# Altium project Current Loop.PrjPcb
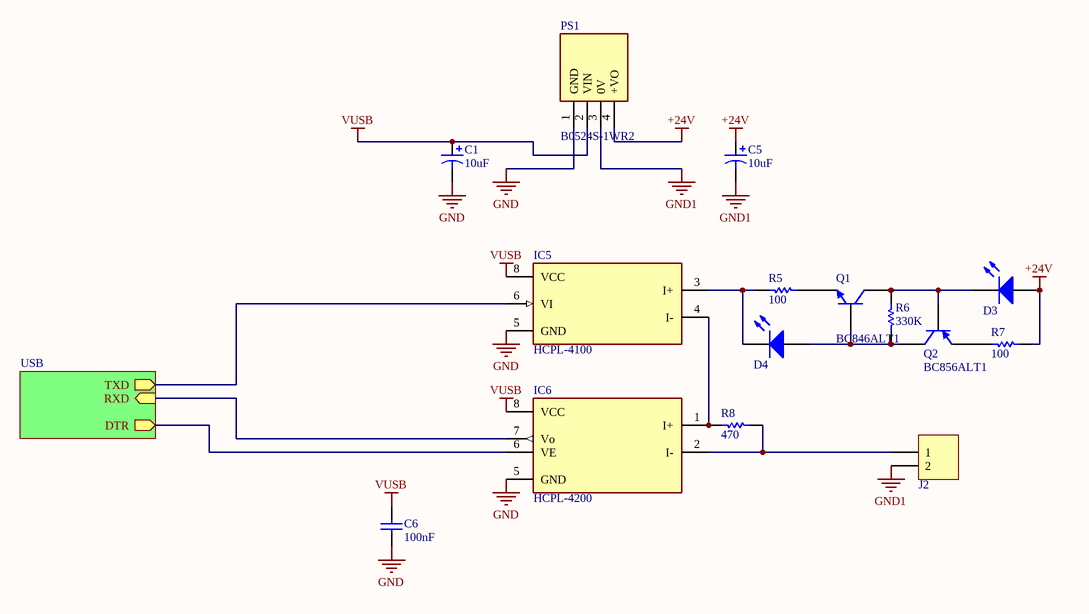
[diagram p0: Main.SchDoc]
2 sheets, 27 parts. Net scope: hierarchical (ports join the sheet entries above them; power ports are global).
Board file: MAIN.PcbDoc
Sheets:
  Main.SchDoc
    USB = ft232.SchDoc

## Sheet Main.SchDoc
size A; SheetNumber: 1; SheetTotal: 8

### Parts
C1  10uF  [CAP-TAN-A]
C5  10uF  [CAP-TAN-A]
C6  100nF  [C603]
D3  LED  [LED-0603]  (value not drawn)
D4  LED  [LED-0603]  (value not drawn)
IC5  HCPL-4100  [SOP-8]
IC6  HCPL-4200  [SOP-8]
J2  CONN-2  [phonix-2]  (value not drawn)
PS1  B0524S-1WR2  [B0524S1WR2]
Q1  BC846ALT1  [SOT-23]
Q2  BC856ALT1  [SOT-23]
R5  100  [r0603]
R6  330K  [r0603]
R7  100  [r0603]
R8  470  [R805]

### Sub-sheets
USB = ft232.SchDoc: RXD (in), TXD (out), DTR (out)

### Nets
+24V: C5.1 D3.1(A) PS1.4(+VO) R7.2
GND: C1.2 C6.1 IC5.5(GND) IC6.5(GND) PS1.1(GND)
GND1: C5.2 J2.2 PS1.3(0V)
VUSB: C1.1 C6.2 IC5.8(VCC) IC6.8(VCC) PS1.2(VIN)
NetD3_2: D3.2(K) Q1.3(C) Q2.1(B) R6.1
NetD4_1: D4.1(A) Q1.1(B) Q2.3(C) R6.2
NetD4_2: D4.2(K) IC5.3(I+) R5.1
NetIC5_4: IC5.4(I-) IC6.1(I+) R8.2
NetIC5_6: IC5.6(VI) ; sheet USB/TXD
NetIC6_2: IC6.2(I-) J2.1 R8.1
NetIC6_6: IC6.6(VE) ; sheet USB/DTR
NetIC6_7: IC6.7(Vo) ; sheet USB/RXD
NetQ1_2: Q1.2(E) R5.2
NetQ2_2: Q2.2(E) R7.1

### Library data of the parts
C1 C5 = CAP-POL: Polar Capacitor; Voltage: 10V; Value: 10uF
C6 = Cap: Capacitor; Designer: Parsa Malekpour; Value: 100nF
IC5 = HCPL-4100: <b>Isolation Amplifer</b><p> Source: http://www.avagotech.com/docs/AV02-0410EN; MF: {'manufacturer': u'Broadcom Limited'}; Package: None; Value: *; Price: None; MP: HCPL-4100; Availability: Unavailable
IC6 = HCPL-4200: Optically Coupled 20 mA Current Loop Receiver; MF: {'manufacturer': u'Broadcom Limited'}; Package: None; Value: *; Price: None; MP: HCPL-4100; Availability: Unavailable
PS1 = B0524S-1WR2: Power Supply; Manufacturer_Name: Mornsun Power; Datasheet Link: https://www.mornsun-power.com/public/uploads/pdf/B_D-1WR2.pdf; Height: 10.16mm; Manufacturer_Part_Number: B0524S-1WR2
Q1 = BC846ALT1: General Purpose Transistor NPN Silicon; Published: 29-Sep-2000; LatestRevisionDate: 17-Jul-2002; LatestRevisionNote: Re-released for DXP Platform.; DatasheetVersion: 1997; PackageVersion: 1997; PackageReference: 318-08; Publisher: Altium Limited; PackageDescription: SOT-23; 3 Leads; Body 3.0 x 2.6 mm, inc. leads (LxW max); ComponentLink1Description: Manufacturer Link; ComponentLink1URL: http://www.onsemi.com/site/products/landing?taxonomyID=194; ComponentLink2Description: Datasheet; ComponentLink2URL: http://www.onsemi.com/pub/Collateral/BC846ALT1-D.PDF
Q2 = BC856ALT1: General Purpose Transistor PNP Silicon; Published: 29-Sep-2000; LatestRevisionDate: 17-Jul-2002; LatestRevisionNote: Re-released for DXP Platform.; DatasheetVersion: 1997; PackageVersion: 1997; PackageReference: 318-08; Publisher: Altium Limited; PackageDescription: SOT-23; 3 Leads; Body 3.0 x 2.6 mm, inc. leads (LxW max); ComponentLink1Description: Manufacturer Link; ComponentLink1URL: http://www.onsemi.com/site/products/landing?taxonomyID=194; ComponentLink2Description: Datasheet; ComponentLink2URL: http://www.onsemi.com/pub/Collateral/BC856ALT1-D.PDF
R5-R8 = Resistor: Designer: Parsa Malekpour
  R5 R7: Value: 100
  R6: Value: 330K
  R8: Value: 470

## Sheet ft232.SchDoc
size A4; SheetNumber: 2; SheetTotal: 7
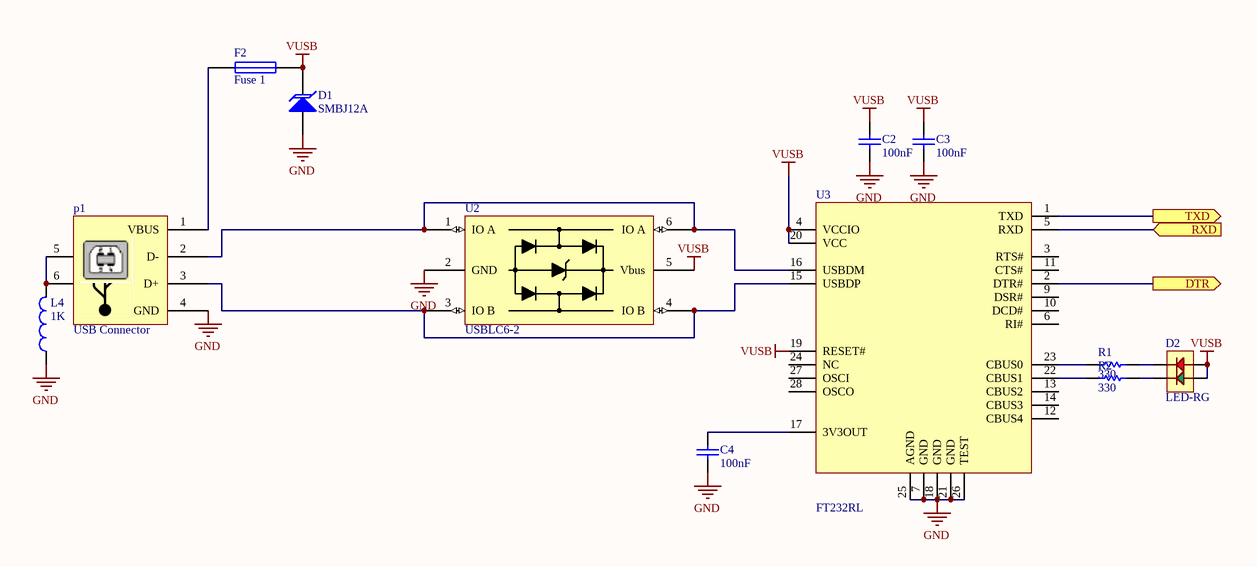
[diagram p1: ft232.SchDoc]

### Parts
C2  100nF  [c603]
C3  100nF  [c603]
C4  100nF  [c603]
D1  SMBJ12A  [DO-214AA]
D2  LED-RG  [LED-1210]
F2  Fuse 1  [PTC-0805]
L4  1K  [r805]
p1  USB Connector  [USB2-B-R]
R1  330  [R0603]
R2  330  [R0603]
U2  USBLC6-2  [SOT-23-6]
U3  FT232RL  [SSOP-28N]

### Ports
DTR (out), RXD (in), TXD (out)

### Nets
GND: C2.1 C3.1 C4.1 D1.1(A) L4.1 p1.4(GND) U2.2(GND) U3.7(GND) U3.18(GND) U3.21(GND) U3.25(AGND) U3.26(TEST)
VUSB: C2.2 C3.2 D1.2(K) D2.1(GRN-A) D2.2(RED-A) F2.2 U2.5(Vbus) U3.4(VCCIO) U3.19(RESET#) U3.20(VCC)
NetC4_2: C4.2 U3.17(3V3OUT)
NetD2_3: D2.3(RED-C) R1.2
NetD2_4: D2.4(GRN-C) R2.2
NetF2_1: F2.1 p1.1(VBUS)
NetIC5_6: U3.1(TXD) ; port TXD
NetIC6_6: U3.2(DTR#) ; port DTR
NetIC6_7: U3.5(RXD) ; port RXD
NetL4_2: L4.2 p1.5 p1.6
Netp1_2: p1.2(D-) U2.1(IO_A) U2.6(IO_A) U3.16(USBDM)
Netp1_3: p1.3(D+) U2.3(IO_B) U2.4(IO_B) U3.15(USBDP)
NetR1_1: R1.1 U3.23(CBUS0)
NetR2_1: R2.1 U3.22(CBUS1)

Not connected (* = marked no-connect by the designer): U3 3(RTS#) 6(RI#) 8(NC) 9(DSR#) 10(DCD#) 11(CTS#) 12(CBUS4) 13(CBUS2) 14(CBUS3) 24(NC) 27(OSCI) 28(OSCO)

### Library data of the parts
C2-C4 = Cap: Capacitor; Designer: Parsa Malekpour; Value: 100nF
D1 = SMBJxxA: Surface Mount Transient Voltage Suppressors Diode; Parameter 1: *
D2 = LED-RG-4
F2 = Fuse 1: Fuse; Published: 8-Jun-2000; LatestRevisionDate: 17-Jul-2002; LatestRevisionNote: Re-released for DXP Platform.; PackageReference: PIN-W2/E2.8; Publisher: Altium Limited; PackageDescription: Thru-Hole; 2 Leads
L4 = Ferrite Bead: Code_IEC: 1005; Published: 8-Jun-2000; LatestRevisionDate: 29-May-2009; LatestRevisionNote: IPC-7351 Footprint Added.; Publisher: Altium Limited; PackageDescription: Chip Inductor; Code_JEITA: 0402; Value: 1K
p1 = USB2-B: USB Connector-B Type; Designer: Eng. Saeid Jorablo; Company: DASE Co; Adding Date: 10/26/2010
R1 R2 = Resistor: Designer: Parsa Malekpour; Value: 330
U2 = USBLC6-2: Very low capacitance ESD protection

## Nets that join several sheets
GND: Main (5 pins), ft232 (12 pins)
VUSB: Main (5 pins), ft232 (10 pins)
NetIC5_6: Main (IC5.6), ft232 (U3.1)
NetIC6_6: Main (IC6.6), ft232 (U3.2)
NetIC6_7: Main (IC6.7), ft232 (U3.5)